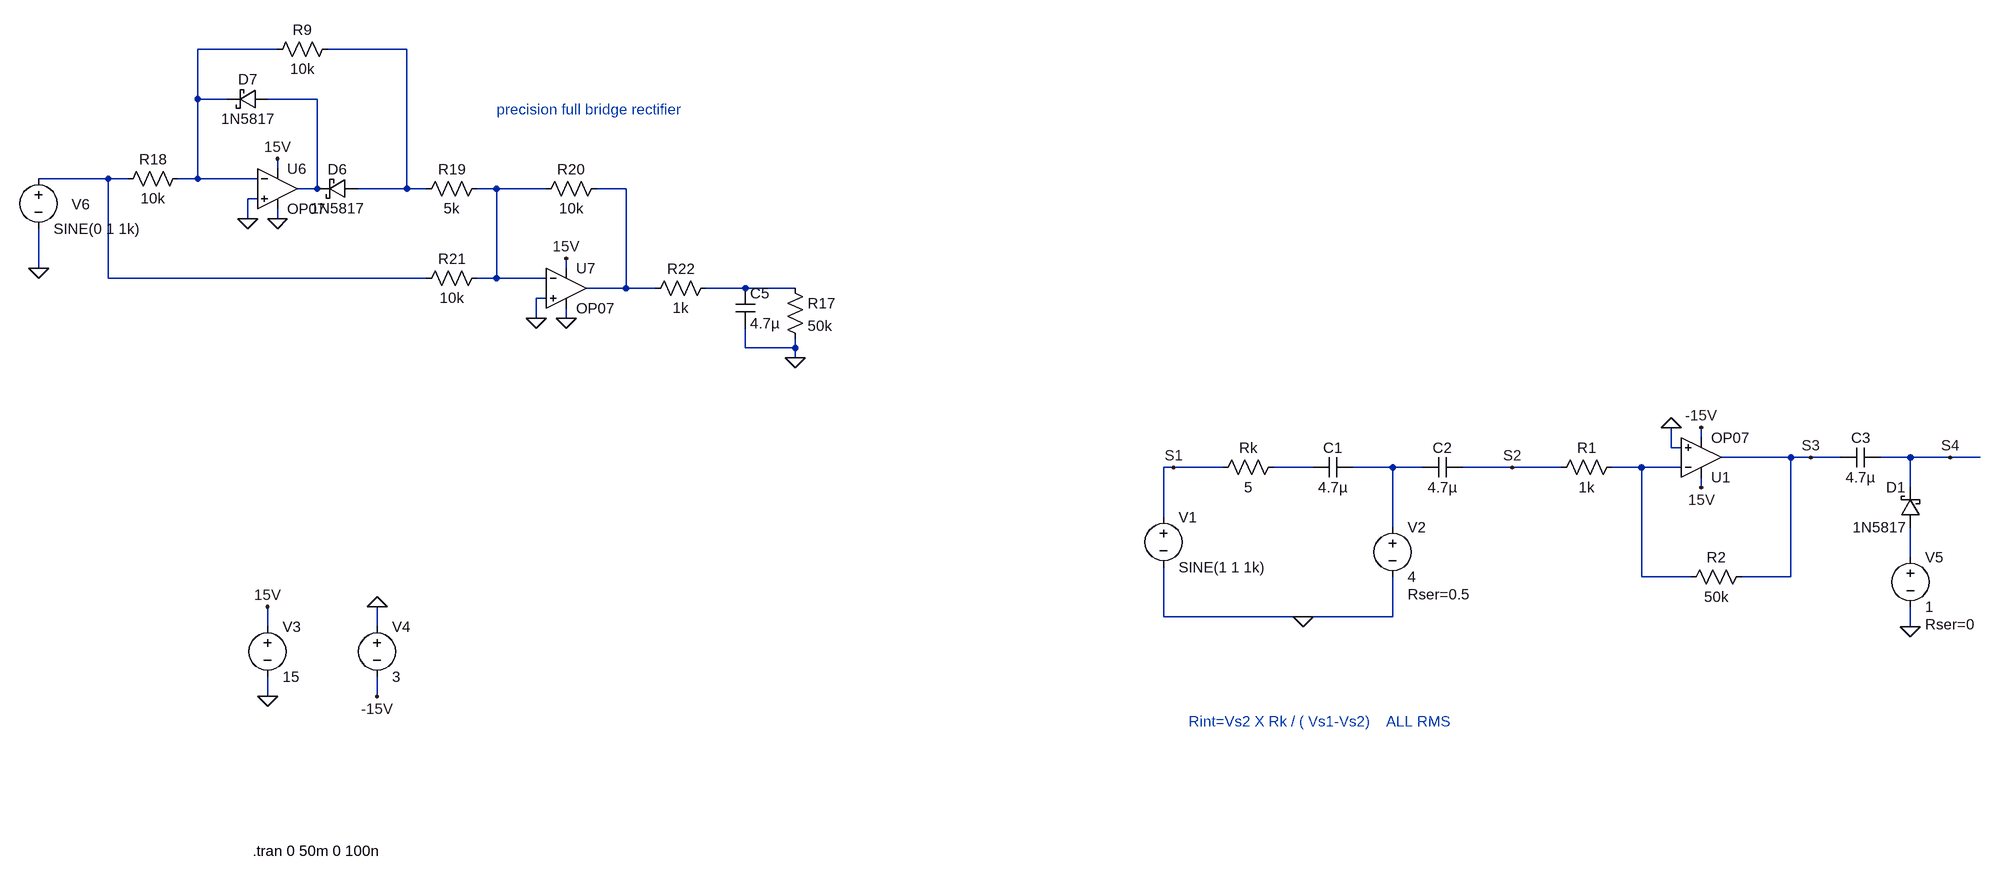
[diagram p0: schematic Internal_Resistance_AC_Method.asc]
Internal_Resistance_AC_Method.asc, the LTspice schematic file:
Version 4
SHEET 1 2100 1044
WIRE -1264 -1072 -1392 -1072
WIRE -1056 -1072 -1184 -1072
WIRE -1392 -992 -1392 -1072
WIRE -1344 -992 -1392 -992
WIRE -1200 -992 -1280 -992
WIRE -1264 -880 -1264 -896
WIRE -1536 -864 -1648 -864
WIRE -1504 -864 -1536 -864
WIRE -1392 -864 -1392 -992
WIRE -1392 -864 -1424 -864
WIRE -1296 -864 -1392 -864
WIRE -1200 -848 -1200 -992
WIRE -1200 -848 -1232 -848
WIRE -1056 -848 -1056 -1072
WIRE -1056 -848 -1136 -848
WIRE -1024 -848 -1056 -848
WIRE -912 -848 -944 -848
WIRE -832 -848 -912 -848
WIRE -704 -848 -752 -848
WIRE -1296 -832 -1312 -832
WIRE -1312 -800 -1312 -832
WIRE -1264 -800 -1264 -816
WIRE -1648 -720 -1648 -784
WIRE -800 -720 -800 -736
WIRE -1536 -704 -1536 -864
WIRE -1024 -704 -1536 -704
WIRE -912 -704 -912 -848
WIRE -912 -704 -944 -704
WIRE -832 -704 -912 -704
WIRE -704 -688 -704 -848
WIRE -704 -688 -768 -688
WIRE -656 -688 -704 -688
WIRE -512 -688 -576 -688
WIRE -432 -688 -512 -688
WIRE -832 -672 -848 -672
WIRE -848 -640 -848 -672
WIRE -800 -640 -800 -656
WIRE -512 -592 -512 -624
WIRE -432 -592 -432 -608
WIRE -432 -592 -512 -592
WIRE -432 -576 -432 -592
WIRE 1024 -448 1024 -464
WIRE 976 -432 976 -464
WIRE 992 -432 976 -432
WIRE 1168 -416 1056 -416
WIRE 1200 -416 1168 -416
WIRE 1248 -416 1200 -416
WIRE 1360 -416 1312 -416
WIRE 1424 -416 1360 -416
WIRE 1472 -416 1424 -416
WIRE 176 -400 160 -400
WIRE 256 -400 176 -400
WIRE 400 -400 336 -400
WIRE 528 -400 464 -400
WIRE 576 -400 528 -400
WIRE 720 -400 640 -400
WIRE 800 -400 720 -400
WIRE 928 -400 880 -400
WIRE 992 -400 928 -400
WIRE 1024 -368 1024 -384
WIRE 1360 -368 1360 -416
WIRE 160 -320 160 -400
WIRE 528 -304 528 -400
WIRE 1360 -256 1360 -304
WIRE 928 -224 928 -400
WIRE 1008 -224 928 -224
WIRE 1168 -224 1168 -416
WIRE 1168 -224 1088 -224
WIRE 160 -160 160 -240
WIRE 384 -160 160 -160
WIRE 528 -160 528 -224
WIRE 528 -160 384 -160
WIRE -1280 -144 -1280 -176
WIRE -1104 -144 -1104 -176
WIRE 1360 -144 1360 -176
WIRE -1280 -32 -1280 -64
WIRE -1104 -32 -1104 -64
FLAG 384 -160 0
FLAG -1280 -32 0
FLAG -1280 -176 15V
FLAG 176 -400 S1
FLAG 720 -400 S2
FLAG -1264 -896 15V
FLAG -1264 -800 0
FLAG -1312 -800 0
FLAG -1648 -720 0
FLAG -432 -576 0
FLAG -800 -736 15V
FLAG -800 -640 0
FLAG -848 -640 0
FLAG 1024 -368 15V
FLAG 1200 -416 S3
FLAG -1104 -176 0
FLAG -1104 -32 -15V
FLAG 1024 -464 -15V
FLAG 976 -464 0
FLAG 1360 -144 0
FLAG 1424 -416 S4
SYMBOL res 352 -416 R90
WINDOW 0 0 56 VBottom 2
WINDOW 3 32 56 VTop 2
SYMATTR InstName Rk
SYMATTR Value 5
SYMBOL cap 464 -416 R90
WINDOW 0 0 32 VBottom 2
WINDOW 3 32 32 VTop 2
SYMATTR InstName C1
SYMATTR Value 4.7µ
SYMBOL voltage 160 -336 R0
WINDOW 123 0 0 Left 0
WINDOW 39 0 0 Left 0
SYMATTR InstName V1
SYMATTR Value SINE(1 1 1k)
SYMBOL voltage 528 -320 R0
WINDOW 123 0 0 Left 0
WINDOW 39 24 124 Left 2
SYMATTR SpiceLine Rser=0.5
SYMATTR InstName V2
SYMATTR Value 4
SYMBOL voltage -1280 -160 R0
WINDOW 123 0 0 Left 0
WINDOW 39 0 0 Left 0
SYMATTR InstName V3
SYMATTR Value 15
SYMBOL Opamps\\OP07 -1264 -912 R0
SYMATTR InstName U6
SYMBOL schottky -1136 -864 R90
WINDOW 0 0 32 VBottom 2
WINDOW 3 32 32 VTop 2
SYMATTR InstName D6
SYMATTR Value 1N5817
SYMATTR Description Diode
SYMATTR Type diode
SYMBOL schottky -1280 -1008 R90
WINDOW 0 0 32 VBottom 2
WINDOW 3 32 32 VTop 2
SYMATTR InstName D7
SYMATTR Value 1N5817
SYMATTR Description Diode
SYMATTR Type diode
SYMBOL res -1168 -1088 R90
WINDOW 0 0 56 VBottom 2
WINDOW 3 32 56 VTop 2
SYMATTR InstName R9
SYMATTR Value 10k
SYMBOL voltage -1648 -880 R0
WINDOW 0 53 57 Left 2
WINDOW 123 0 0 Left 0
WINDOW 39 0 0 Left 0
SYMATTR InstName V6
SYMATTR Value SINE(0 1 1k)
SYMBOL res -448 -704 R0
SYMATTR InstName R17
SYMATTR Value 50k
SYMBOL res -1408 -880 R90
WINDOW 0 0 56 VBottom 2
WINDOW 3 32 56 VTop 2
SYMATTR InstName R18
SYMATTR Value 10k
SYMBOL Opamps\\OP07 -800 -752 R0
SYMATTR InstName U7
SYMBOL res -928 -864 R90
WINDOW 0 0 56 VBottom 2
WINDOW 3 32 56 VTop 2
SYMATTR InstName R19
SYMATTR Value 5k
SYMBOL res -736 -864 R90
WINDOW 0 0 56 VBottom 2
WINDOW 3 32 56 VTop 2
SYMATTR InstName R20
SYMATTR Value 10k
SYMBOL res -928 -720 R90
WINDOW 0 0 56 VBottom 2
WINDOW 3 32 56 VTop 2
SYMATTR InstName R21
SYMATTR Value 10k
SYMBOL cap -528 -688 R0
SYMATTR InstName C5
SYMATTR Value 4.7µ
SYMBOL res -560 -704 R90
WINDOW 0 0 56 VBottom 2
WINDOW 3 32 56 VTop 2
SYMATTR InstName R22
SYMATTR Value 1k
SYMBOL cap 640 -416 R90
WINDOW 0 0 32 VBottom 2
WINDOW 3 32 32 VTop 2
SYMATTR InstName C2
SYMATTR Value 4.7µ
SYMBOL Opamps\\OP07 1024 -352 M180
SYMATTR InstName U1
SYMBOL voltage -1104 -160 R0
WINDOW 123 0 0 Left 0
WINDOW 39 0 0 Left 0
SYMATTR InstName V4
SYMATTR Value 3
SYMBOL res 896 -416 R90
WINDOW 0 0 56 VBottom 2
WINDOW 3 32 56 VTop 2
SYMATTR InstName R1
SYMATTR Value 1k
SYMBOL res 1104 -240 R90
WINDOW 0 0 56 VBottom 2
WINDOW 3 32 56 VTop 2
SYMATTR InstName R2
SYMATTR Value 50k
SYMBOL cap 1312 -432 R90
WINDOW 0 0 32 VBottom 2
WINDOW 3 32 32 VTop 2
SYMATTR InstName C3
SYMATTR Value 4.7µ
SYMBOL voltage 1360 -272 R0
WINDOW 123 0 0 Left 0
WINDOW 39 24 124 Left 2
SYMATTR SpiceLine Rser=0
SYMATTR InstName V5
SYMATTR Value 1
SYMBOL schottky 1376 -304 R180
WINDOW 0 24 64 Left 2
WINDOW 3 24 0 Left 2
SYMATTR InstName D1
SYMATTR Value 1N5817
SYMATTR Description Diode
SYMATTR Type diode
TEXT -1304 216 Left 2 !.tran 0 50m 0 100n
TEXT 200 8 Left 2 ;Rint=Vs2 X Rk / ( Vs1-Vs2)    ALL RMS
TEXT -912 -976 Left 2 ;precision full bridge rectifier

The netlist it stands for:
* Internal_Resistance_AC_Method.asc
Rk N008 S1 5
C1 N009 N008 4.7µ
V1 S1 0 SINE(1 1 1k)
V2 N009 0 4 Rser=0.5
V3 15V 0 15
XU6 0 N001 15V 0 N003 LT1001  ; OP07, pins In+ In- V+ V- OUT
D6 N002 N003 1N5817
D7 N003 N001 1N5817
R9 N002 N001 10k
V6 N004 0 SINE(0 1 1k)
R17 N007 0 50k
R18 N001 N004 10k
XU7 0 N005 15V 0 N006 LT1001  ; OP07, pins In+ In- V+ V- OUT
R19 N005 N002 5k
R20 N006 N005 10k
R21 N005 N004 10k
C5 N007 0 4.7µ
R22 N007 N006 1k
C2 S2 N009 4.7µ
XU1 0 N010 15V -15V S3 LT1001  ; OP07, pins In+ In- V+ V- OUT
V4 0 -15V 3
R1 N010 S2 1k
R2 S3 N010 50k
C3 S4 S3 4.7µ
V5 N011 0 1 Rser=0
D1 N011 S4 1N5817
.model D D
.lib standard.dio
.tran 0 50m 0 100n
* Rint=Vs2 X Rk / ( Vs1-Vs2)    ALL RMS
* precision full bridge rectifier
.lib LTC.lib
.backanno
.end